# Altium project BeagleNode.PrjPcb
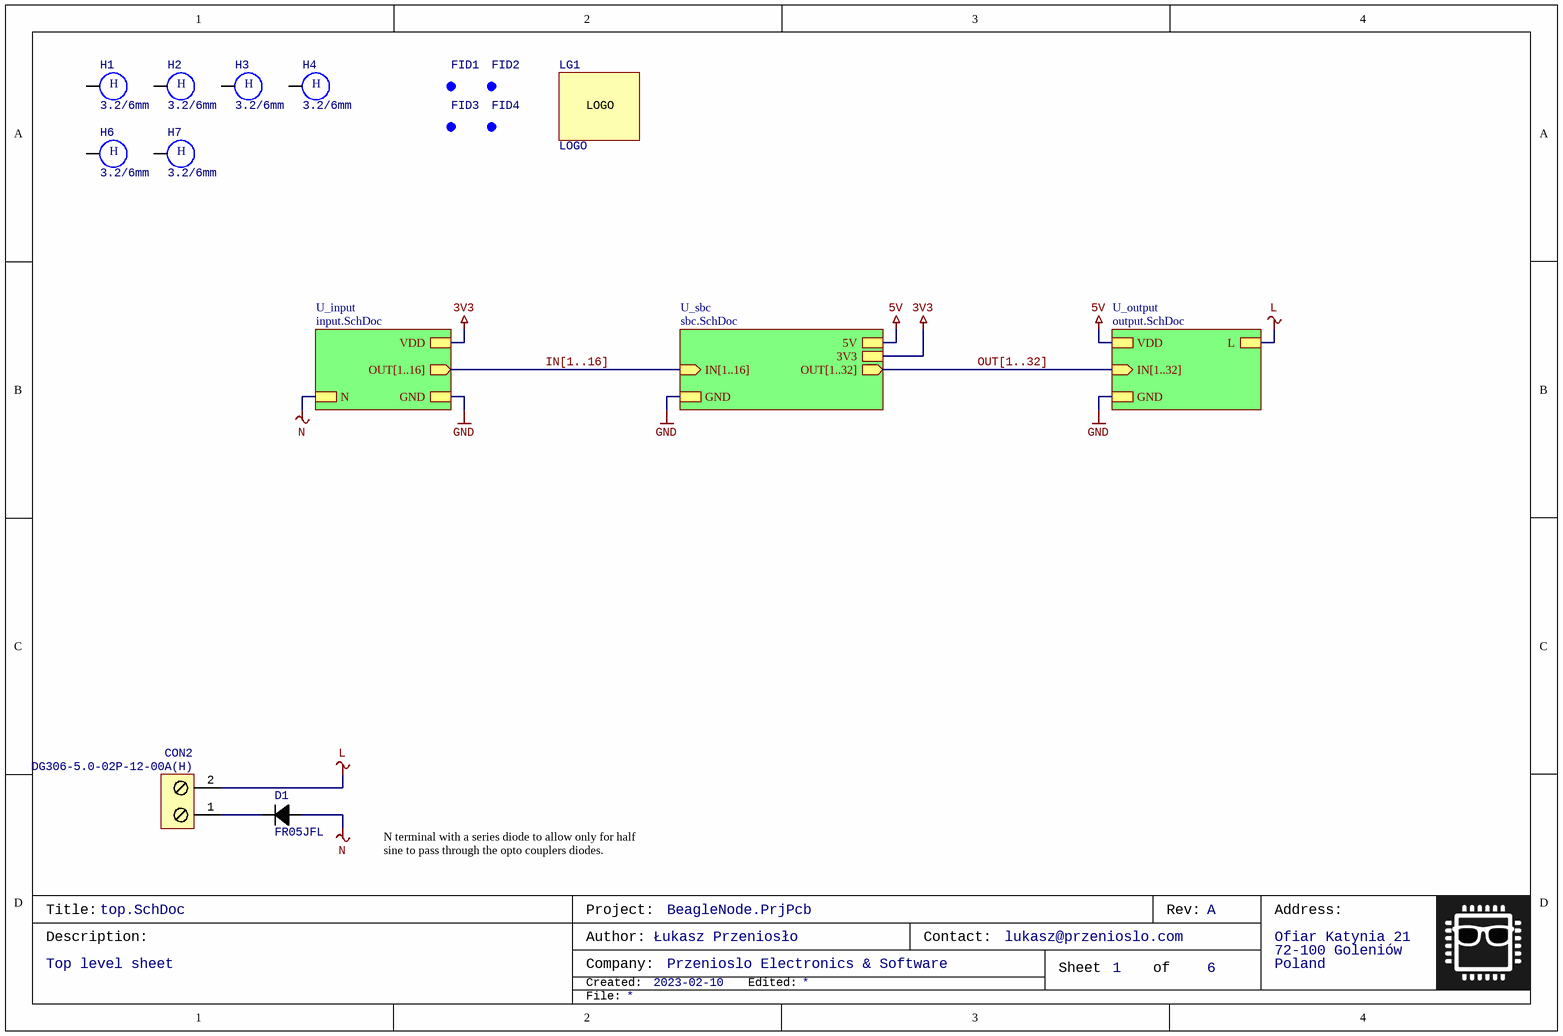
[diagram p0: top.SchDoc]
Author: Łukasz Przeniosło; CompanyName: Przenioslo Electronics & Software; Engineer: lukasz@przenioslo.com; Revision: A
6 sheets, 246 parts. Net scope: strictly hierarchical (ports join the sheet entries above them; power ports are local).
Board file: BeagleNode_revA.PcbDoc
Sheets:
  top.SchDoc
    U_input = input.SchDoc
      IA = opto.SchDoc
      IB = opto.SchDoc
      IC = opto.SchDoc
      ID = opto.SchDoc
    U_output = output.SchDoc
      K1 = relay.SchDoc
      K2 = relay.SchDoc
      K3 = relay.SchDoc
      K4 = relay.SchDoc
      K5 = relay.SchDoc
      K6 = relay.SchDoc
      K7 = relay.SchDoc
      K8 = relay.SchDoc
      K9 = relay.SchDoc
      K10 = relay.SchDoc
      K11 = relay.SchDoc
      K12 = relay.SchDoc
      K13 = relay.SchDoc
      K14 = relay.SchDoc
      K15 = relay.SchDoc
      K16 = relay.SchDoc
    U_sbc = sbc.SchDoc

## Sheet top.SchDoc: Top level sheet
size A4; Date: 2023-02-10; DocumentNumber: 1; SheetNumber: 1; SheetTotal: 6

### Parts
CON2  DG306-5.0-02P-12-00A(H)  [Terminal-block-2way-5.0]
D1  FR05JFL  [SOD323]
FID1  Generic fidutial  [FID_ROUND]  (value not drawn)  (no BOM)
FID2  Generic fidutial  [FID_ROUND]  (value not drawn)  (no BOM)
FID3  Generic fidutial  [FID_ROUND]  (value not drawn)  (no BOM)
FID4  Generic fidutial  [FID_ROUND]  (value not drawn)  (no BOM)
H1  3.2/6mm  [hole-3.2/6]  (no BOM)
H2  3.2/6mm  [hole-3.2/6]  (no BOM)
H3  3.2/6mm  [hole-3.2/6]  (no BOM)
H4  3.2/6mm  [hole-3.2/6]  (no BOM)
H6  3.2/6mm  [hole-3.2/6]  (no BOM)
H7  3.2/6mm  [hole-3.2/6]  (no BOM)
LG1  LOGO  [LOGO_ENS]  (no BOM)

### Sub-sheets
U_input = input.SchDoc: OUT[1..16] (out), VDD, GND, N
U_output = output.SchDoc: L, VDD, GND, IN[1..32] (in)
U_sbc = sbc.SchDoc: 3V3, GND, 5V, IN[1..16] (in), OUT[1..32] (out)

### Nets
3V3: sheet U_input/VDD, sheet U_sbc/3V3
5V: sheet U_output/VDD, sheet U_sbc/5V
GND: sheet U_input/GND, sheet U_output/GND, sheet U_sbc/GND
L: CON2.2 ; sheet U_output/L
N: D1.2(A) ; sheet U_input/N
NetCON2_1: CON2.1 D1.1(K)

Not connected (* = marked no-connect by the designer): H1 1; H2 1; H3 1; H4 1; H6 1; H7 1

### Buses and harness runs
bus IN[1..16] = sheet U_input/OUT[1..16] = sheet U_sbc/IN[1..16]
bus OUT[1..32] = sheet U_output/IN[1..32] = sheet U_sbc/OUT[1..32]

### Notes on the sheet
- N terminal with a series diode to allow only for half sine to pass through the opto couplers diodes.
- Title:
- Project:
- Rev:
- Address:
- Description:
- Created:
- Author:
- Company:
- Edited:
- Contact:
- Sheet
- of
- Ofiar Katynia 21
- 72-100 Goleniów
- Poland
- File:
- (in symbol hole_metalized) H

### Library data of the parts
CON2 = Terminal Block 2: Screwed terminal block with 2 pins; Manufacturer: DEGSON ELECTRONICS; Identifier: DG306-5.0-02P-12-00A(H)
D1 = FR05xFL: FAST RECOVERY SURFACE MOUNT GLASS PASSIVATED RECTIFIER; Manufacturer: DC Components; V_R: 600V; I_F: 0.5A; V_F: 1.3V; Identifier: FR05JFL
FID1-FID4 = FID: Optical alignement fidutial PCB element (not visible in bom); Identifier: Generic fidutial
H1-H4 H6 H7 = hole_metalized: Generic hole component with 1 electrical connection; size: 3.2/6mm
LG1 = LOGO: Logo graphical object

## Sheet input.SchDoc: 230 VAC switches inputs connectors circuit
size A4; Date: 2023-02-07; Organization: PRZENIOSLO; Address1: Electronics; Address2: &; Address3: Software; DocumentNumber: 2; SheetNumber: 2; SheetTotal: 6
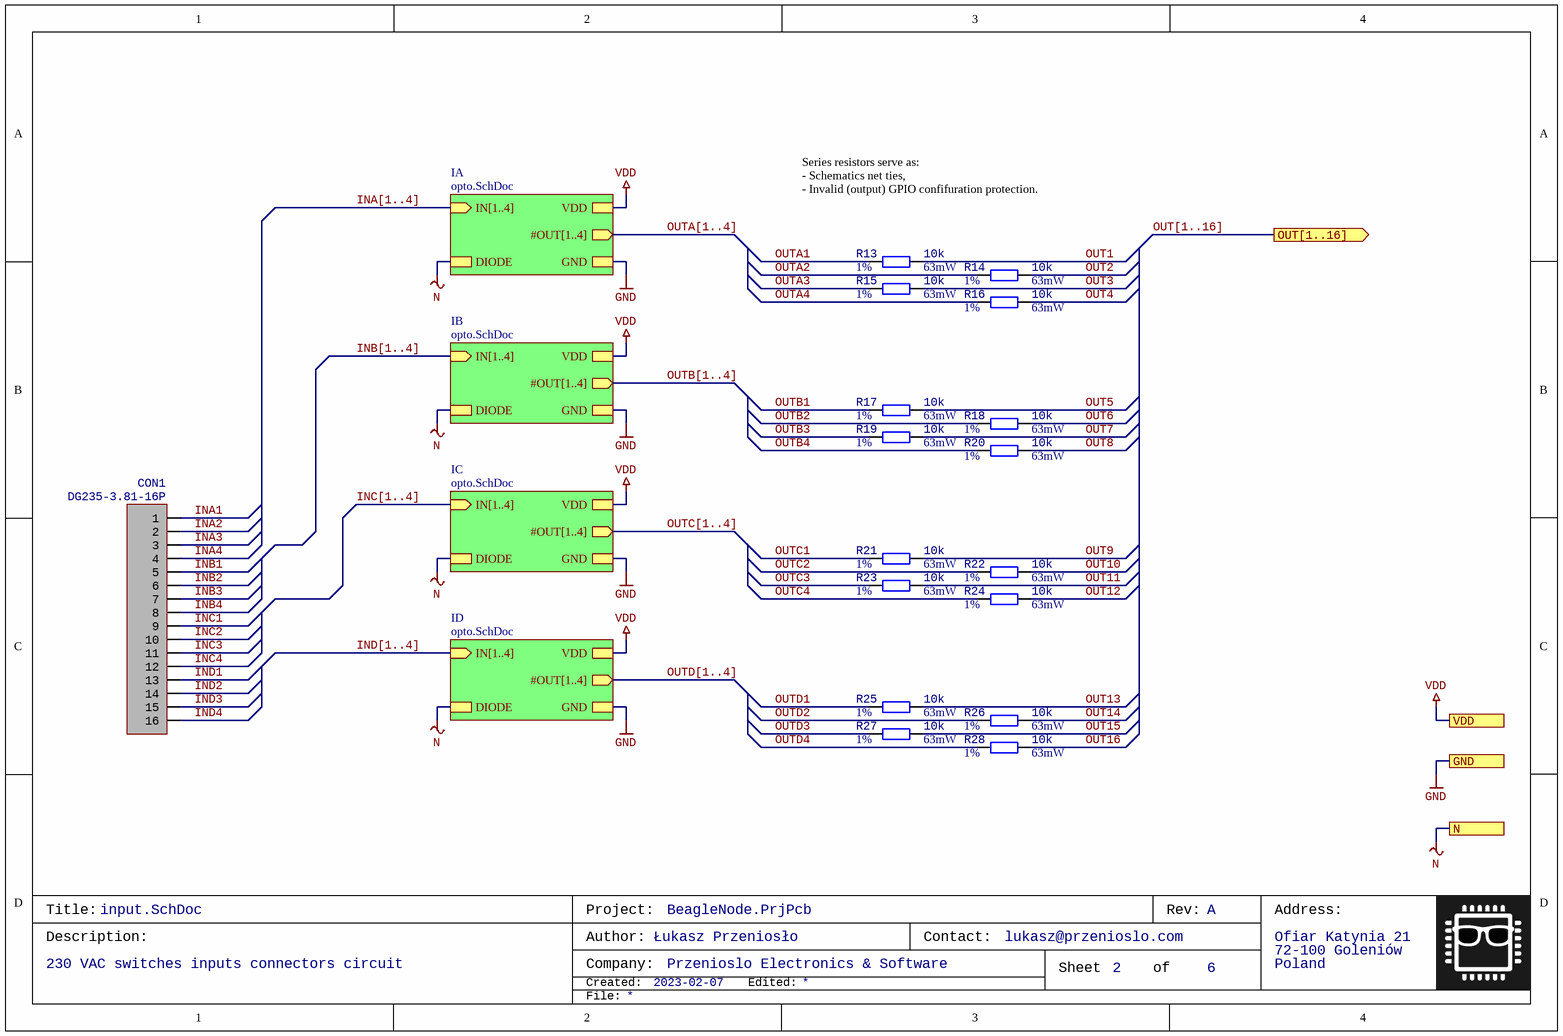
[diagram p1: input.SchDoc]

### Parts
CON1  DG235-3.81-16P  [DG235-3.81-16P]
R13  10k  Power: 63mW  Tolerance: 1%  [RES0603]
R14  10k  Power: 63mW  Tolerance: 1%  [RES0603]
R15  10k  Power: 63mW  Tolerance: 1%  [RES0603]
R16  10k  Power: 63mW  Tolerance: 1%  [RES0603]
R17  10k  Power: 63mW  Tolerance: 1%  [RES0603]
R18  10k  Power: 63mW  Tolerance: 1%  [RES0603]
R19  10k  Power: 63mW  Tolerance: 1%  [RES0603]
R20  10k  Power: 63mW  Tolerance: 1%  [RES0603]
R21  10k  Power: 63mW  Tolerance: 1%  [RES0603]
R22  10k  Power: 63mW  Tolerance: 1%  [RES0603]
R23  10k  Power: 63mW  Tolerance: 1%  [RES0603]
R24  10k  Power: 63mW  Tolerance: 1%  [RES0603]
R25  10k  Power: 63mW  Tolerance: 1%  [RES0603]
R26  10k  Power: 63mW  Tolerance: 1%  [RES0603]
R27  10k  Power: 63mW  Tolerance: 1%  [RES0603]
R28  10k  Power: 63mW  Tolerance: 1%  [RES0603]

### Sub-sheets
IA = opto.SchDoc: #OUT[1..4] (out), IN[1..4] (in), DIODE, VDD, GND
IB = opto.SchDoc: #OUT[1..4] (out), IN[1..4] (in), DIODE, VDD, GND
IC = opto.SchDoc: #OUT[1..4] (out), IN[1..4] (in), DIODE, VDD, GND
ID = opto.SchDoc: #OUT[1..4] (out), IN[1..4] (in), DIODE, VDD, GND

### Ports
GND, N, OUT[1..16] (out), VDD

### Nets
GND: port GND, sheet IA/GND, sheet IB/GND, sheet IC/GND, sheet ID/GND
N: port N, sheet IA/DIODE, sheet IB/DIODE, sheet IC/DIODE, sheet ID/DIODE
VDD: port VDD, sheet IA/VDD, sheet IB/VDD, sheet IC/VDD, sheet ID/VDD  [project net 3V3]
INA1: CON1.1  [project net INA1_2]
INA2: CON1.2  [project net INA2_2]
INA3: CON1.3  [project net INA3_2]
INA4: CON1.4  [project net INA4_2]
INB1: CON1.5  [project net INB1_2]
INB2: CON1.6  [project net INB2_2]
INB3: CON1.7  [project net INB3_2]
INB4: CON1.8  [project net INB4_2]
INC1: CON1.9  [project net INC1_2]
INC2: CON1.10  [project net INC2_2]
INC3: CON1.11  [project net INC3_2]
INC4: CON1.12  [project net INC4_2]
IND1: CON1.13  [project net IND1_2]
IND2: CON1.14  [project net IND2_2]
IND3: CON1.15  [project net IND3_2]
IND4: CON1.16  [project net IND4_2]
OUT1: R13.1  [project net IN1]
OUT2: R14.1  [project net IN2]
OUT3: R15.1  [project net IN3]
OUT4: R16.1  [project net IN4]
OUT5: R17.1  [project net IN5]
OUT6: R18.1  [project net IN6]
OUT7: R19.1  [project net IN7]
OUT8: R20.1  [project net IN8]
OUT9: R21.1  [project net IN9]
OUT10: R22.1  [project net IN10]
OUT11: R23.1  [project net IN11]
OUT12: R24.1  [project net IN12]
OUT13: R25.1  [project net IN13]
OUT14: R26.1  [project net IN14]
OUT15: R27.1  [project net IN15]
OUT16: R28.1  [project net IN16]
OUTA1: R13.2
OUTA2: R14.2
OUTA3: R15.2
OUTA4: R16.2
OUTB1: R17.2
OUTB2: R18.2
OUTB3: R19.2
OUTB4: R20.2
OUTC1: R21.2
OUTC2: R22.2
OUTC3: R23.2
OUTC4: R24.2
OUTD1: R25.2
OUTD2: R26.2
OUTD3: R27.2
OUTD4: R28.2

### Buses and harness runs
bus INA[1..4] = sheet IA/IN[1..4]
bus INB[1..4] = sheet IB/IN[1..4]
bus INC[1..4] = sheet IC/IN[1..4]
bus IND[1..4] = sheet ID/IN[1..4]
bus OUT[1..16] = port OUT[1..16]
bus OUTA[1..4] = sheet IA/#OUT[1..4]
bus OUTB[1..4] = sheet IB/#OUT[1..4]
bus OUTC[1..4] = sheet IC/#OUT[1..4]
bus OUTD[1..4] = sheet ID/#OUT[1..4]

### Notes on the sheet
- Series resistors serve as:
  - Schematics net ties,
  - Invalid (output) GPIO confifuration protection.
- Title:
- Project:
- Rev:
- Address:
- Description:
- Created:
- Author:
- Company:
- Edited:
- Contact:
- Sheet
- of
- Ofiar Katynia 21
- 72-100 Goleniów
- Poland
- File:

### Library data of the parts
CON1 = DG235-3.81-16P: PCB spring terminal blocks,Rated current:10A.Rated voltage （III/2）:250V,pitch:3.81mm,Color:gray,Contact surface :Tin; Manufacturer: DEGSON ELECTRONICS; Nominal Current: 5A; Identifier: DG235-3.81-16P
R13-R28 = Resistor: Generic resistor symbol; Value: 10k; Manufacturer: *; Identifier: *; Datasheet: *

## Sheet opto.SchDoc: High voltage quad opto isolation circuit
size A4; Date: 20xx-xx-xx; Author: Łukasz Przeniosło; CompanyName: Przenioslo Electronics & Software; Engineer: lukasz@przenioslo.com; Organization: PRZENIOSLO; Address1: Electronics; Address2: &; Address3: Software; DocumentNumber: 3; SheetNumber: 3; SheetTotal: 6
Used 4 times, as channels U_input/IA, U_input/IB, U_input/IC, U_input/ID. Parts and nets are listed once, with the designators drawn on the sheet.
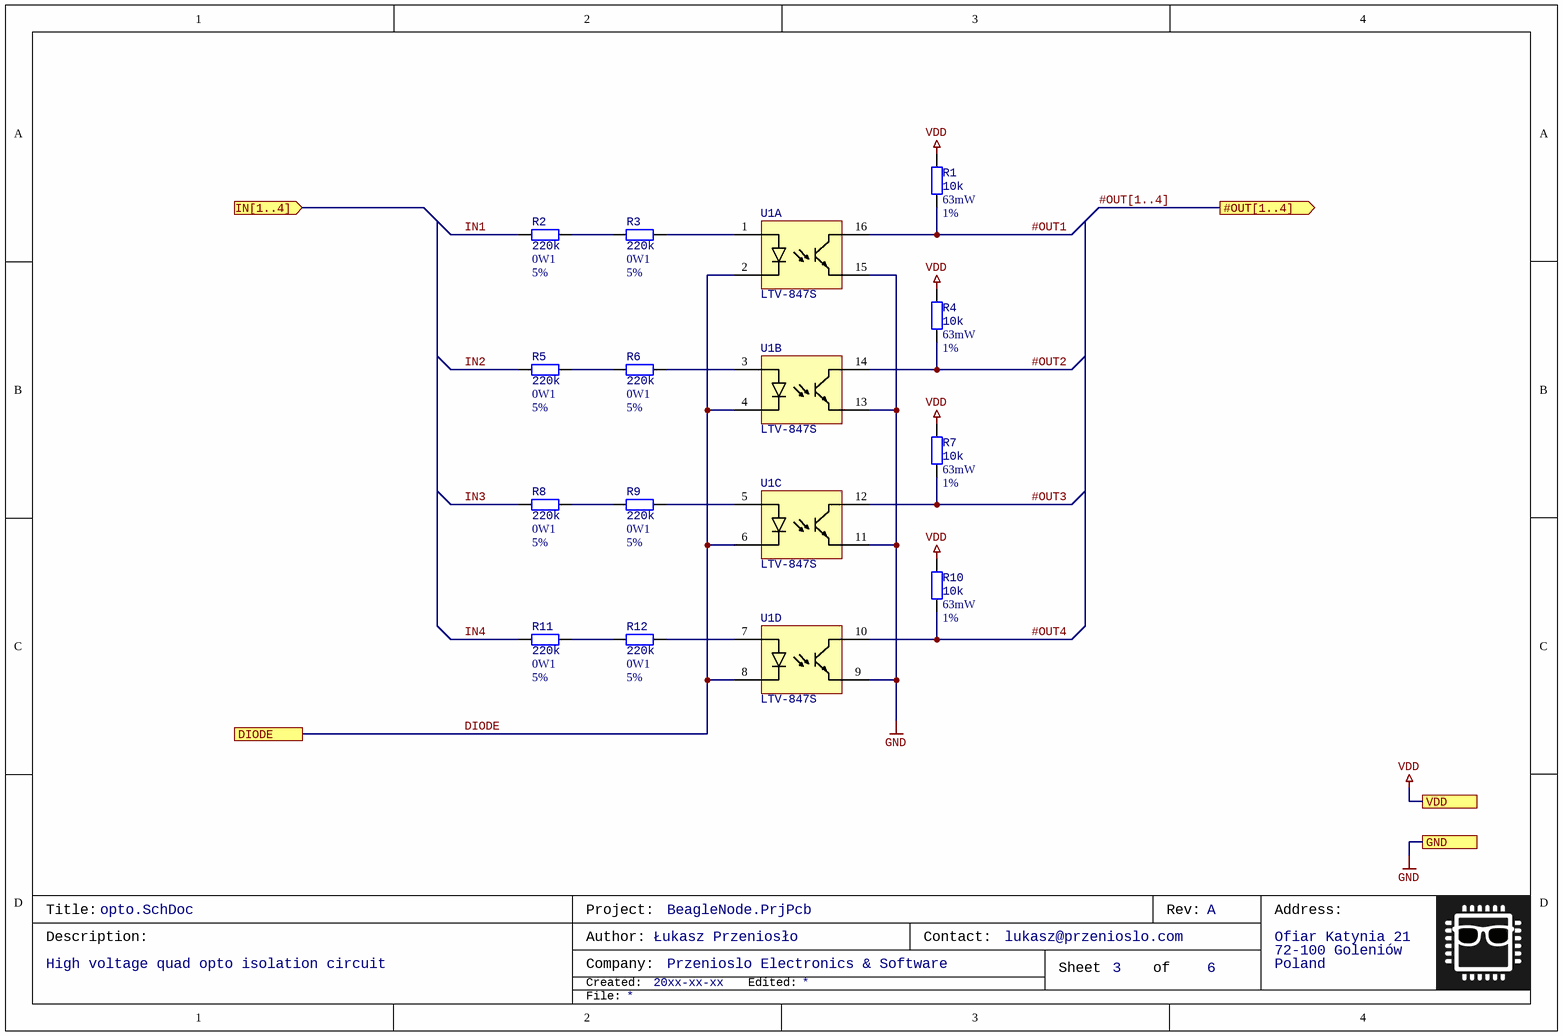
[diagram p2: opto.SchDoc]

### Parts
R1  10k  Power: 63mW  Tolerance: 1%  [RES0603]
R2  220k  Power: 0W1  Tolerance: 5%  [RES0603]
R3  220k  Power: 0W1  Tolerance: 5%  [RES0603]
R4  10k  Power: 63mW  Tolerance: 1%  [RES0603]
R5  220k  Power: 0W1  Tolerance: 5%  [RES0603]
R6  220k  Power: 0W1  Tolerance: 5%  [RES0603]
R7  10k  Power: 63mW  Tolerance: 1%  [RES0603]
R8  220k  Power: 0W1  Tolerance: 5%  [RES0603]
R9  220k  Power: 0W1  Tolerance: 5%  [RES0603]
R10  10k  Power: 63mW  Tolerance: 1%  [RES0603]
R11  220k  Power: 0W1  Tolerance: 5%  [RES0603]
R12  220k  Power: 0W1  Tolerance: 5%  [RES0603]
U1  LTV-847S  [GULLWING16]  (parts A,B,C,D of 4)

### Ports
#OUT[1..4] (out), DIODE, GND, IN[1..4] (in), VDD

### Nets
GND: U1.9(E4) U1.11(E3) U1.13(E2) U1.15(E1) ; port GND
VDD: R1.2 R4.2 R7.2 R10.2 ; port VDD
#OUT1: R1.1 U1.16(C1)  [project net #OUT1_3]
#OUT2: R4.1 U1.14(C2)  [project net #OUT2_3]
#OUT3: R7.1 U1.12(C3)  [project net #OUT3_3]
#OUT4: R10.1 U1.10(C4)  [project net #OUT4_3]
DIODE: U1.2(K1) U1.4(K2) U1.6(K3) U1.8(K4) ; port DIODE
IN1: R2.2  [project net IN1_3]
IN2: R5.2  [project net IN2_3]
IN3: R8.2  [project net IN3_3]
IN4: R11.2  [project net IN4_3]
NetR2_1: R2.1 R3.2
NetR3_1: R3.1 U1.1(A1)
NetR5_1: R5.1 R6.2
NetR6_1: R6.1 U1.3(A2)
NetR8_1: R8.1 R9.2
NetR9_1: R9.1 U1.5(A3)
NetR11_1: R11.1 R12.2
NetR12_1: R12.1 U1.7(A4)

### Channels
U_input/IA: designators R1=IAR1 R2=IAR2 R3=IAR3 R4=IAR4 R5=IAR5 R6=IAR6 R7=IAR7 R8=IAR8 R9=IAR9 R10=IAR10 R11=IAR11 R12=IAR12 U1=IAU1; ports DIODE=N GND=GND VDD=3V3
U_input/IB: designators R1=IBR1 R2=IBR2 R3=IBR3 R4=IBR4 R5=IBR5 R6=IBR6 R7=IBR7 R8=IBR8 R9=IBR9 R10=IBR10 R11=IBR11 R12=IBR12 U1=IBU1; ports DIODE=N GND=GND VDD=3V3
U_input/IC: designators R1=ICR1 R2=ICR2 R3=ICR3 R4=ICR4 R5=ICR5 R6=ICR6 R7=ICR7 R8=ICR8 R9=ICR9 R10=ICR10 R11=ICR11 R12=ICR12 U1=ICU1; ports DIODE=N GND=GND VDD=3V3
U_input/ID: designators R1=IDR1 R2=IDR2 R3=IDR3 R4=IDR4 R5=IDR5 R6=IDR6 R7=IDR7 R8=IDR8 R9=IDR9 R10=IDR10 R11=IDR11 R12=IDR12 U1=IDU1; ports DIODE=N GND=GND VDD=3V3

### Buses and harness runs
bus #OUT[1..4] = port #OUT[1..4]

### Notes on the sheet
- Title:
- Project:
- Rev:
- Address:
- Description:
- Created:
- Author:
- Company:
- Edited:
- Contact:
- Sheet
- of
- Ofiar Katynia 21
- 72-100 Goleniów
- Poland
- File:

### Library data of the parts
R1-R12 = Resistor: Generic resistor symbol; Manufacturer: *; Identifier: *; Datasheet: *
  R1 R4 R7 R10: Value: 10k
  R2 R3 R5 R6 R8 R9 R11 R12: Value: 220k
U1 = Transoptor_16pin: Quad transoptor in 16 pin package; Manufacturer: Liteon; Identifier: LTV-847S

## Sheet output.SchDoc: 230 VAC outputs connector circuit
size A4; Date: 2023-02-11; DocumentNumber: 4; SheetNumber: 4; SheetTotal: 6
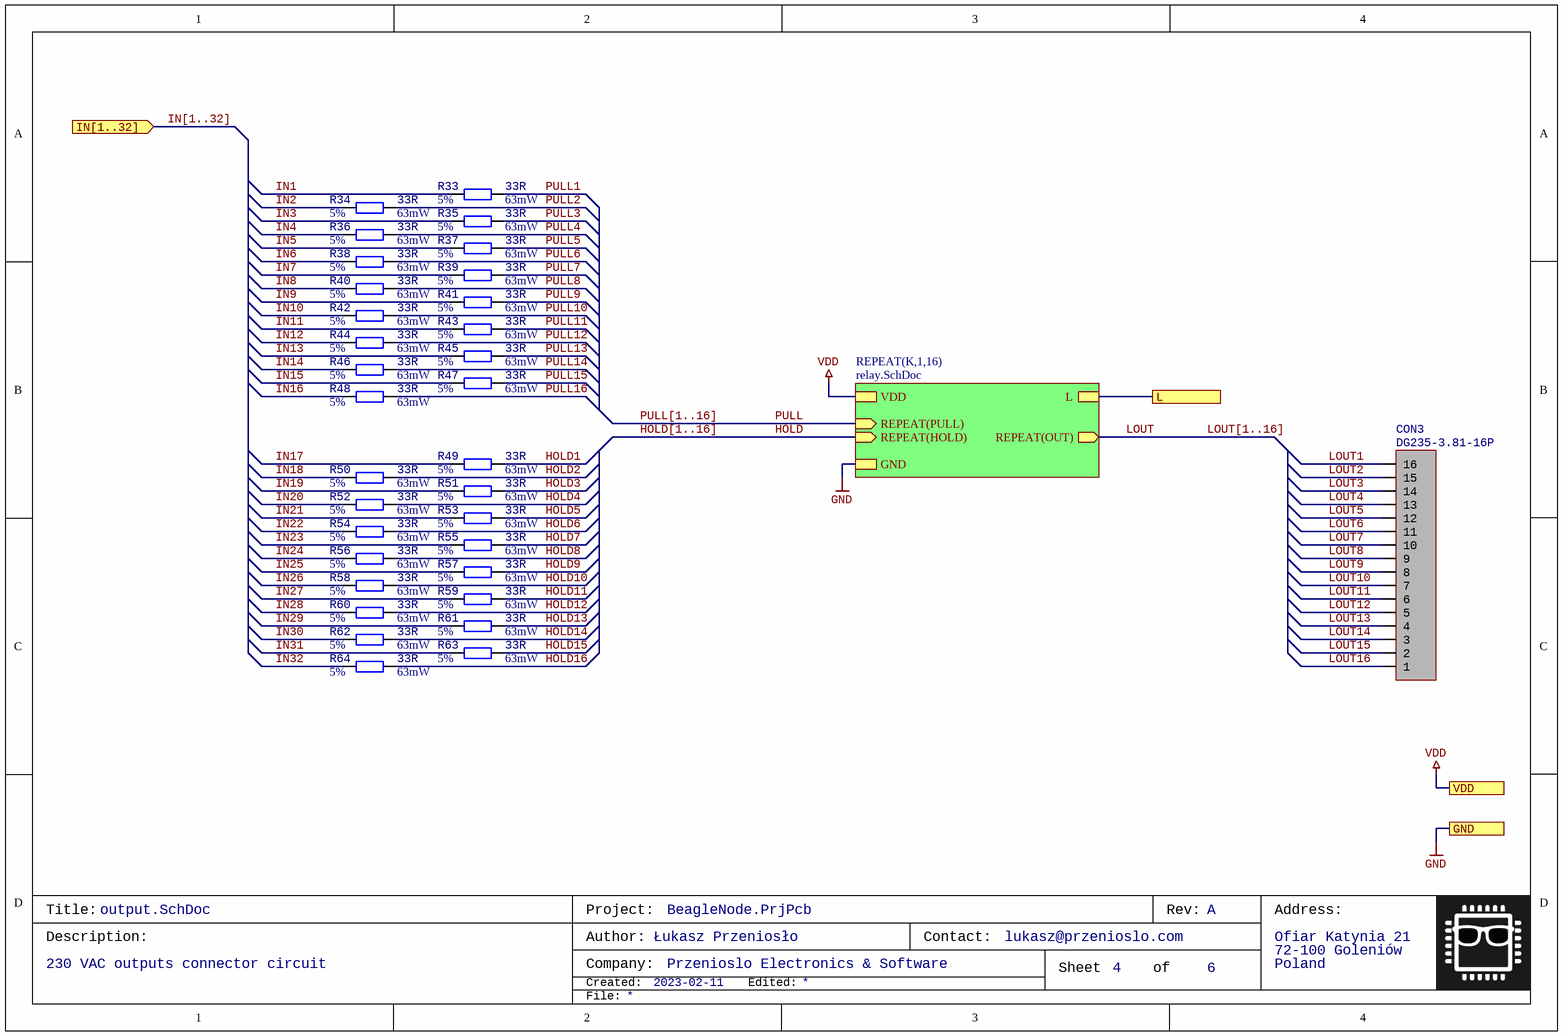
[diagram p3: output.SchDoc]

### Parts
CON3  DG235-3.81-16P  [DG235-3.81-16P]
R33  33R  Power: 63mW  Tolerance: 5%  [RES0603]
R34  33R  Power: 63mW  Tolerance: 5%  [RES0603]
R35  33R  Power: 63mW  Tolerance: 5%  [RES0603]
R36  33R  Power: 63mW  Tolerance: 5%  [RES0603]
R37  33R  Power: 63mW  Tolerance: 5%  [RES0603]
R38  33R  Power: 63mW  Tolerance: 5%  [RES0603]
R39  33R  Power: 63mW  Tolerance: 5%  [RES0603]
R40  33R  Power: 63mW  Tolerance: 5%  [RES0603]
R41  33R  Power: 63mW  Tolerance: 5%  [RES0603]
R42  33R  Power: 63mW  Tolerance: 5%  [RES0603]
R43  33R  Power: 63mW  Tolerance: 5%  [RES0603]
R44  33R  Power: 63mW  Tolerance: 5%  [RES0603]
R45  33R  Power: 63mW  Tolerance: 5%  [RES0603]
R46  33R  Power: 63mW  Tolerance: 5%  [RES0603]
R47  33R  Power: 63mW  Tolerance: 5%  [RES0603]
R48  33R  Power: 63mW  Tolerance: 5%  [RES0603]
R49  33R  Power: 63mW  Tolerance: 5%  [RES0603]
R50  33R  Power: 63mW  Tolerance: 5%  [RES0603]
R51  33R  Power: 63mW  Tolerance: 5%  [RES0603]
R52  33R  Power: 63mW  Tolerance: 5%  [RES0603]
R53  33R  Power: 63mW  Tolerance: 5%  [RES0603]
R54  33R  Power: 63mW  Tolerance: 5%  [RES0603]
R55  33R  Power: 63mW  Tolerance: 5%  [RES0603]
R56  33R  Power: 63mW  Tolerance: 5%  [RES0603]
R57  33R  Power: 63mW  Tolerance: 5%  [RES0603]
R58  33R  Power: 63mW  Tolerance: 5%  [RES0603]
R59  33R  Power: 63mW  Tolerance: 5%  [RES0603]
R60  33R  Power: 63mW  Tolerance: 5%  [RES0603]
R61  33R  Power: 63mW  Tolerance: 5%  [RES0603]
R62  33R  Power: 63mW  Tolerance: 5%  [RES0603]
R63  33R  Power: 63mW  Tolerance: 5%  [RES0603]
R64  33R  Power: 63mW  Tolerance: 5%  [RES0603]

### Sub-sheets
REPEAT(K,1,16) = relay.SchDoc: REPEAT(OUT) (out), L, REPEAT(PULL) (in), REPEAT(HOLD) (in), VDD, GND

### Ports
GND, IN[1..32] (in), L, VDD

### Nets
GND: port GND, sheet REPEAT(K,1,16)/GND
L: port L, sheet REPEAT(K,1,16)/L
VDD: port VDD, sheet REPEAT(K,1,16)/VDD  [project net 5V]
HOLD: sheet REPEAT(K,1,16)/REPEAT(HOLD)
HOLD1: R49.2
HOLD2: R50.2
HOLD3: R51.2
HOLD4: R52.2
HOLD5: R53.2
HOLD6: R54.2
HOLD7: R55.2
HOLD8: R56.2
HOLD9: R57.2
HOLD10: R58.2
HOLD11: R59.2
HOLD12: R60.2
HOLD13: R61.2
HOLD14: R62.2
HOLD15: R63.2
HOLD16: R64.2
IN1: R33.1  [project net OUT1]
IN2: R34.1  [project net OUT2]
IN3: R35.1  [project net OUT3]
IN4: R36.1  [project net OUT4]
IN5: R37.1  [project net OUT5]
IN6: R38.1  [project net OUT6]
IN7: R39.1  [project net OUT7]
IN8: R40.1  [project net OUT8]
IN9: R41.1  [project net OUT9]
IN10: R42.1  [project net OUT10]
IN11: R43.1  [project net OUT11]
IN12: R44.1  [project net OUT12]
IN13: R45.1  [project net OUT13]
IN14: R46.1  [project net OUT14]
IN15: R47.1  [project net OUT15]
IN16: R48.1  [project net OUT16]
IN17: R49.1  [project net OUT17]
IN18: R50.1  [project net OUT18]
IN19: R51.1  [project net OUT19]
IN20: R52.1  [project net OUT20]
IN21: R53.1  [project net OUT21]
IN22: R54.1  [project net OUT22]
IN23: R55.1  [project net OUT23]
IN24: R56.1  [project net OUT24]
IN25: R57.1  [project net OUT25]
IN26: R58.1  [project net OUT26]
IN27: R59.1  [project net OUT27]
IN28: R60.1  [project net OUT28]
IN29: R61.1  [project net OUT29]
IN30: R62.1  [project net OUT30]
IN31: R63.1  [project net OUT31]
IN32: R64.1  [project net OUT32]
LOUT: sheet REPEAT(K,1,16)/REPEAT(OUT)
LOUT1: CON3.16
LOUT2: CON3.15
LOUT3: CON3.14
LOUT4: CON3.13
LOUT5: CON3.12
LOUT6: CON3.11
LOUT7: CON3.10
LOUT8: CON3.9
LOUT9: CON3.8
LOUT10: CON3.7
LOUT11: CON3.6
LOUT12: CON3.5
LOUT13: CON3.4
LOUT14: CON3.3
LOUT15: CON3.2
LOUT16: CON3.1
PULL: sheet REPEAT(K,1,16)/REPEAT(PULL)
PULL1: R33.2
PULL2: R34.2
PULL3: R35.2
PULL4: R36.2
PULL5: R37.2
PULL6: R38.2
PULL7: R39.2
PULL8: R40.2
PULL9: R41.2
PULL10: R42.2
PULL11: R43.2
PULL12: R44.2
PULL13: R45.2
PULL14: R46.2
PULL15: R47.2
PULL16: R48.2

### Buses and harness runs
bus HOLD[1..16]
bus IN[1..32] = port IN[1..32]
bus LOUT[1..16]
bus PULL[1..16]

### Notes on the sheet
- Title:
- Project:
- Rev:
- Address:
- Description:
- Created:
- Author:
- Company:
- Edited:
- Contact:
- Sheet
- of
- Ofiar Katynia 21
- 72-100 Goleniów
- Poland
- File:

### Library data of the parts
CON3 = DG235-3.81-16P: as CON1 on sheet input; Identifier: DG235-3.81-16P
R33-R64 = Resistor: Generic resistor symbol; Value: 33R; Manufacturer: *; Identifier: *; Datasheet: *

## Sheet relay.SchDoc: 230 VAC output relay control circuit
size A4; Date: 2023-02-10; DocumentNumber: 5; SheetNumber: 6; SheetTotal: 6
Used 16 times, as channels U_output/K1, U_output/K2, U_output/K3, U_output/K4, U_output/K5, U_output/K6, U_output/K7, U_output/K8, U_output/K9, U_output/K10, U_output/K11, U_output/K12, U_output/K13, U_output/K14, U_output/K15, U_output/K16. Parts and nets are listed once, with the designators drawn on the sheet.
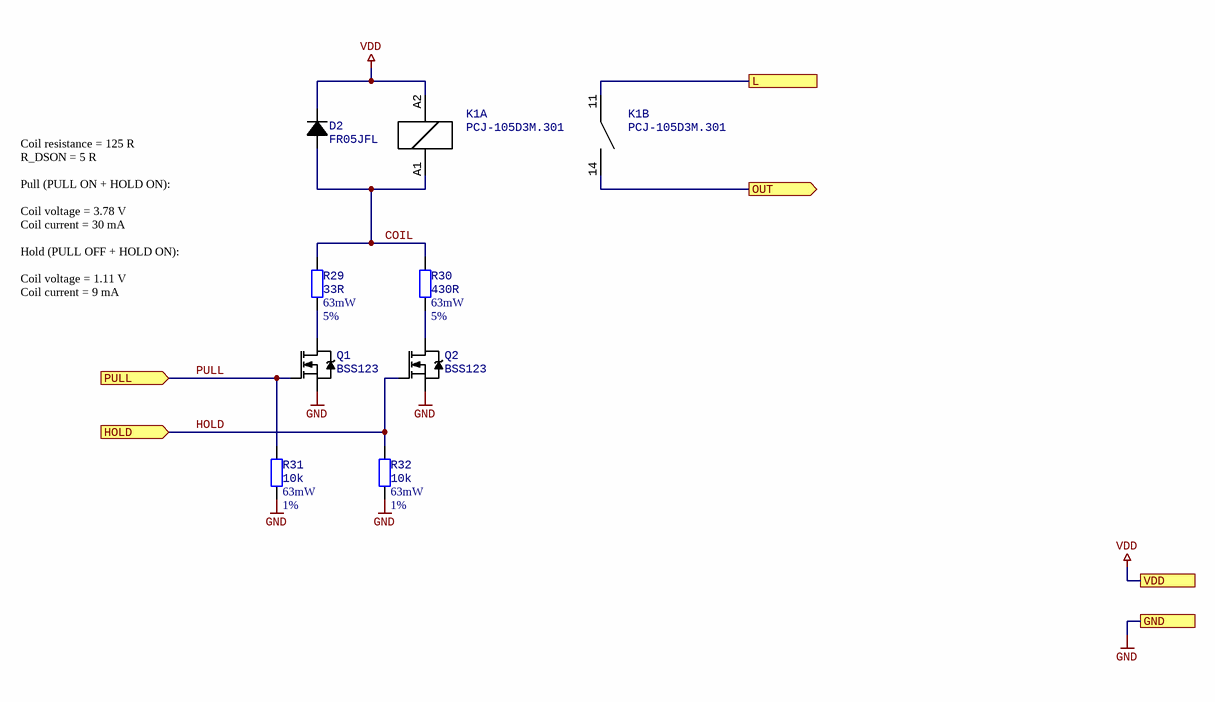
[diagram p4: relay.SchDoc]

### Parts
D2  FR05JFL  [SOD323]
K1  PCJ-105D3M.301  [1721081-2]  (parts A,B of 2)
Q1  BSS123  [sot23-3l]
Q2  BSS123  [sot23-3l]
R29  33R  Power: 63mW  Tolerance: 5%  [RES0603]
R30  430R  Power: 63mW  Tolerance: 5%  [RES0603]
R31  10k  Power: 63mW  Tolerance: 1%  [RES0603]
R32  10k  Power: 63mW  Tolerance: 1%  [RES0603]

### Ports
GND, HOLD (in), L, OUT (out), PULL (in), VDD

### Nets
GND: Q1.2(S) Q2.2(S) R31.2 R32.2 ; port GND
VDD: D2.1(K) K1.A2 ; port VDD
COIL: D2.2(A) K1.A1 R29.1 R30.1  [project net COIL_6]
HOLD: Q2.1(G) R32.1 ; port HOLD
L: K1.11 ; port L
OUT: K1.14 ; port OUT
PULL: Q1.1(G) R31.1 ; port PULL
NetQ1_3: Q1.3(D) R29.2
NetQ2_3: Q2.3(D) R30.2

### Channels
U_output/K1: designators D2=K1D2 K1=K1K1 Q1=K1Q1 Q2=K1Q2 R29=K1R29 R30=K1R30 R31=K1R31 R32=K1R32; ports GND=GND HOLD=HOLD1 L=L OUT=LOUT1 PULL=PULL1 VDD=5V
U_output/K2: designators D2=K2D2 K1=K2K1 Q1=K2Q1 Q2=K2Q2 R29=K2R29 R30=K2R30 R31=K2R31 R32=K2R32; ports GND=GND HOLD=HOLD2 L=L OUT=LOUT2 PULL=PULL2 VDD=5V
U_output/K3: designators D2=K3D2 K1=K3K1 Q1=K3Q1 Q2=K3Q2 R29=K3R29 R30=K3R30 R31=K3R31 R32=K3R32; ports GND=GND HOLD=HOLD3 L=L OUT=LOUT3 PULL=PULL3 VDD=5V
U_output/K4: designators D2=K4D2 K1=K4K1 Q1=K4Q1 Q2=K4Q2 R29=K4R29 R30=K4R30 R31=K4R31 R32=K4R32; ports GND=GND HOLD=HOLD4 L=L OUT=LOUT4 PULL=PULL4 VDD=5V
U_output/K5: designators D2=K5D2 K1=K5K1 Q1=K5Q1 Q2=K5Q2 R29=K5R29 R30=K5R30 R31=K5R31 R32=K5R32; ports GND=GND HOLD=HOLD5 L=L OUT=LOUT5 PULL=PULL5 VDD=5V
U_output/K6: designators D2=K6D2 K1=K6K1 Q1=K6Q1 Q2=K6Q2 R29=K6R29 R30=K6R30 R31=K6R31 R32=K6R32; ports GND=GND HOLD=HOLD6 L=L OUT=LOUT6 PULL=PULL6 VDD=5V
U_output/K7: designators D2=K7D2 K1=K7K1 Q1=K7Q1 Q2=K7Q2 R29=K7R29 R30=K7R30 R31=K7R31 R32=K7R32; ports GND=GND HOLD=HOLD7 L=L OUT=LOUT7 PULL=PULL7 VDD=5V
U_output/K8: designators D2=K8D2 K1=K8K1 Q1=K8Q1 Q2=K8Q2 R29=K8R29 R30=K8R30 R31=K8R31 R32=K8R32; ports GND=GND HOLD=HOLD8 L=L OUT=LOUT8 PULL=PULL8 VDD=5V
U_output/K9: designators D2=K9D2 K1=K9K1 Q1=K9Q1 Q2=K9Q2 R29=K9R29 R30=K9R30 R31=K9R31 R32=K9R32; ports GND=GND HOLD=HOLD9 L=L OUT=LOUT9 PULL=PULL9 VDD=5V
U_output/K10: designators D2=K10D2 K1=K10K1 Q1=K10Q1 Q2=K10Q2 R29=K10R29 R30=K10R30 R31=K10R31 R32=K10R32; ports GND=GND HOLD=HOLD10 L=L OUT=LOUT10 PULL=PULL10 VDD=5V
U_output/K11: designators D2=K11D2 K1=K11K1 Q1=K11Q1 Q2=K11Q2 R29=K11R29 R30=K11R30 R31=K11R31 R32=K11R32; ports GND=GND HOLD=HOLD11 L=L OUT=LOUT11 PULL=PULL11 VDD=5V
U_output/K12: designators D2=K12D2 K1=K12K1 Q1=K12Q1 Q2=K12Q2 R29=K12R29 R30=K12R30 R31=K12R31 R32=K12R32; ports GND=GND HOLD=HOLD12 L=L OUT=LOUT12 PULL=PULL12 VDD=5V
U_output/K13: designators D2=K13D2 K1=K13K1 Q1=K13Q1 Q2=K13Q2 R29=K13R29 R30=K13R30 R31=K13R31 R32=K13R32; ports GND=GND HOLD=HOLD13 L=L OUT=LOUT13 PULL=PULL13 VDD=5V
U_output/K14: designators D2=K14D2 K1=K14K1 Q1=K14Q1 Q2=K14Q2 R29=K14R29 R30=K14R30 R31=K14R31 R32=K14R32; ports GND=GND HOLD=HOLD14 L=L OUT=LOUT14 PULL=PULL14 VDD=5V
U_output/K15: designators D2=K15D2 K1=K15K1 Q1=K15Q1 Q2=K15Q2 R29=K15R29 R30=K15R30 R31=K15R31 R32=K15R32; ports GND=GND HOLD=HOLD15 L=L OUT=LOUT15 PULL=PULL15 VDD=5V
U_output/K16: designators D2=K16D2 K1=K16K1 Q1=K16Q1 Q2=K16Q2 R29=K16R29 R30=K16R30 R31=K16R31 R32=K16R32; ports GND=GND HOLD=HOLD16 L=L OUT=LOUT16 PULL=PULL16 VDD=5V

### Notes on the sheet
- Coil resistance = 125 R
  R_DSON = 5 R
  Pull (PULL ON + HOLD ON):
  Coil voltage = 3.78 V
  Coil current = 30 mA
  Hold (PULL OFF + HOLD ON):
  Coil voltage = 1.11 V
  Coil current = 9 mA
- Title:
- Project:
- Rev:
- Address:
- Description:
- Created:
- Author:
- Company:
- Edited:
- Contact:
- Sheet
- of
- Ofiar Katynia 21
- 72-100 Goleniów
- Poland
- File:

### Library data of the parts
D2 = FR05xFL: as D1 on sheet top; Identifier: FR05JFL
K1 = PCJ-1xxD3M.301: Miniature PCB Relay PCJ; Manufacturer: TE Connectivity; Identifier: PCJ-105D3M.301
Q1 Q2 = BSS123: N-Channel Logic Level Enhancement Mode Field Effect Transistor; V_GS_tres: 2V; V_GSS: +-20V; V_DSS: 100V; I_D: 170mA; Identifier: BSS123
R29-R32 = Resistor: Generic resistor symbol; Manufacturer: *; Identifier: *; Datasheet: *
  R29: Value: 33R
  R30: Value: 430R
  R31 R32: Value: 10k

## Sheet sbc.SchDoc: BeagleBone Black connectors
size A4; Date: 2023-02-11; DocumentNumber: 6; SheetNumber: 2; SheetTotal: 6
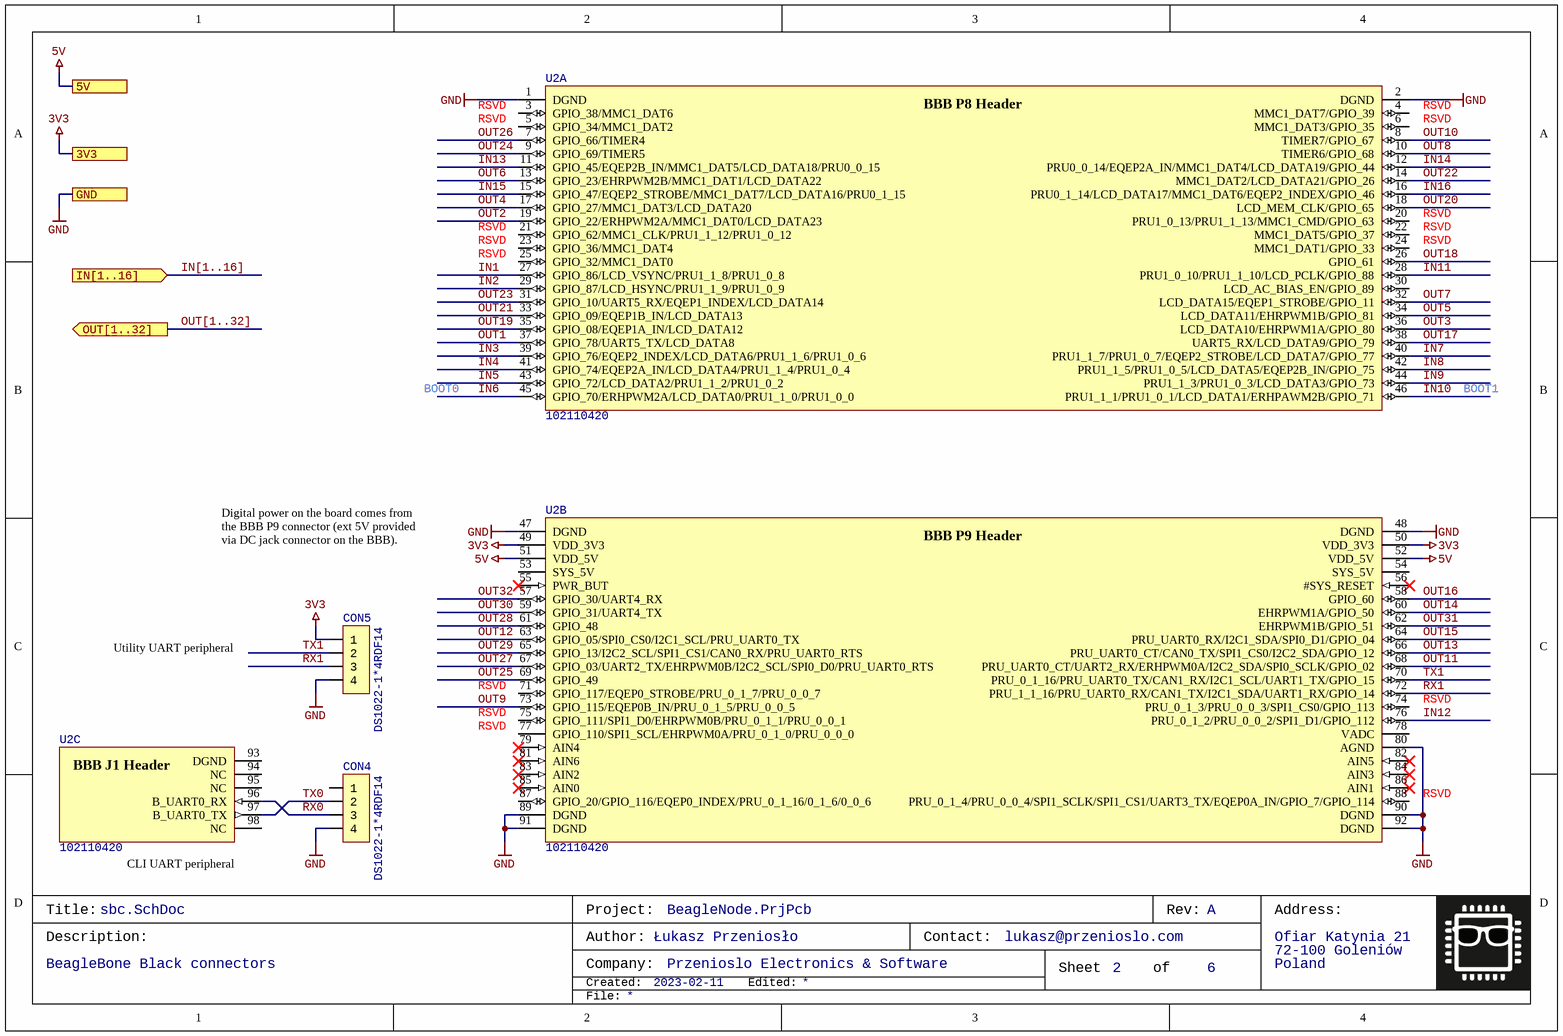
[diagram p5: sbc.SchDoc]

### Parts
CON4  DS1022-1*4RDF14  [HMTA_1X4_2.54_3.60]
CON5  DS1022-1*4RDF14  [HMTA_1X4_2.54_3.60]
U2  102110420  [BeagleBone Black No Bat]  (parts A,B,C of 3)

### Ports
3V3, 5V, GND, IN[1..16] (in), OUT[1..32] (out)

### Nets
3V3: CON5.1 U2.49(VDD_3V3) U2.50(VDD_3V3) ; port 3V3
5V: U2.51(VDD_5V) U2.52(VDD_5V) ; port 5V
GND: CON4.4 CON5.4 U2.1(DGND) U2.2(DGND) U2.47(DGND) U2.48(DGND) U2.80(AGND) U2.89(DGND) U2.90(DGND) U2.91(DGND) U2.92(DGND) ; port GND
IN1: U2.27(GPIO_86/LCD_VSYNC/PRU1_1_8/PRU1_0_8)
IN2: U2.29(GPIO_87/LCD_HSYNC/PRU1_1_9/PRU1_0_9)
IN3: U2.39(GPIO_76/EQEP2_INDEX/LCD_DATA6/PRU1_1_6/PRU1_0_6)
IN4: U2.41(GPIO_74/EQEP2A_IN/LCD_DATA4/PRU1_1_4/PRU1_0_4)
IN5: U2.43(GPIO_72/LCD_DATA2/PRU1_1_2/PRU1_0_2)
IN6: U2.45(GPIO_70/ERHPWM2A/LCD_DATA0/PRU1_1_0/PRU1_0_0)
IN7: U2.40(PRU1_1_7/PRU1_0_7/EQEP2_STROBE/LCD_DATA7/GPIO_77)
IN8: U2.42(PRU1_1_5/PRU1_0_5/LCD_DATA5/EQEP2B_IN/GPIO_75)
IN9: U2.44(PRU1_1_3/PRU1_0_3/LCD_DATA3/GPIO_73)
IN10: U2.46(PRU1_1_1/PRU1_0_1/LCD_DATA1/ERHPAWM2B/GPIO_71)
IN11: U2.28(PRU1_0_10/PRU1_1_10/LCD_PCLK/GPIO_88)
IN12: U2.76(PRU_0_1_2/PRU_0_0_2/SPI1_D1/GPIO_112)
IN13: U2.11(GPIO_45/EQEP2B_IN/MMC1_DAT5/LCD_DATA18/PRU0_0_15)
IN14: U2.12(PRU0_0_14/EQEP2A_IN/MMC1_DAT4/LCD_DATA19/GPIO_44)
IN15: U2.15(GPIO_47/EQEP2_STROBE/MMC1_DAT7/LCD_DATA16/PRU0_1_15)
IN16: U2.16(PRU0_1_14/LCD_DATA17/MMC1_DAT6/EQEP2_INDEX/GPIO_46)
OUT1: U2.37(GPIO_78/UART5_TX/LCD_DATA8)
OUT2: U2.19(GPIO_22/ERHPWM2A/MMC1_DAT0/LCD_DATA23)
OUT3: U2.36(LCD_DATA10/EHRPWM1A/GPIO_80)
OUT4: U2.17(GPIO_27/MMC1_DAT3/LCD_DATA20)
OUT5: U2.34(LCD_DATA11/EHRPWM1B/GPIO_81)
OUT6: U2.13(GPIO_23/EHRPWM2B/MMC1_DAT1/LCD_DATA22)
OUT7: U2.32(LCD_DATA15/EQEP1_STROBE/GPIO_11)
OUT8: U2.10(TIMER6/GPIO_68)
OUT9: U2.73(GPIO_115/EQEP0B_IN/PRU_0_1_5/PRU_0_0_5)
OUT10: U2.8(TIMER7/GPIO_67)
OUT11: U2.68(PRU_UART0_CT/UART2_RX/ERHPWM0A/I2C2_SDA/SPI0_SCLK/GPIO_02)
OUT12: U2.63(GPIO_05/SPI0_CS0/I2C1_SCL/PRU_UART0_TX)
OUT13: U2.66(PRU_UART0_CT/CAN0_TX/SPI1_CS0/I2C2_SDA/GPIO_12)
OUT14: U2.60(EHRPWM1A/GPIO_50)
OUT15: U2.64(PRU_UART0_RX/I2C1_SDA/SPI0_D1/GPIO_04)
OUT16: U2.58(GPIO_60)
OUT17: U2.38(UART5_RX/LCD_DATA9/GPIO_79)
OUT18: U2.26(GPIO_61)
OUT19: U2.35(GPIO_08/EQEP1A_IN/LCD_DATA12)
OUT20: U2.18(LCD_MEM_CLK/GPIO_65)
OUT21: U2.33(GPIO_09/EQEP1B_IN/LCD_DATA13)
OUT22: U2.14(MMC1_DAT2/LCD_DATA21/GPIO_26)
OUT23: U2.31(GPIO_10/UART5_RX/EQEP1_INDEX/LCD_DATA14)
OUT24: U2.9(GPIO_69/TIMER5)
OUT25: U2.69(GPIO_49)
OUT26: U2.7(GPIO_66/TIMER4)
OUT27: U2.67(GPIO_03/UART2_TX/EHRPWM0B/I2C2_SCL/SPI0_D0/PRU_UART0_RTS)
OUT28: U2.61(GPIO_48)
OUT29: U2.65(GPIO_13/I2C2_SCL/SPI1_CS1/CAN0_RX/PRU_UART0_RTS)
OUT30: U2.59(GPIO_31/UART4_TX)
OUT31: U2.62(EHRPWM1B/GPIO_51)
OUT32: U2.57(GPIO_30/UART4_RX)
RX0: CON4.3 U2.96(B_UART0_RX)  [project net RX0_2]
RX1: CON5.3 U2.72(PRU_1_1_16/PRU_UART0_RX/CAN1_TX/I2C1_SDA/UART1_RX/GPIO_14)  [project net RX1_2]
TX0: CON4.2 U2.97(B_UART0_TX)  [project net TX0_2]
TX1: CON5.2 U2.70(PRU_0_1_16/PRU_UART0_TX/CAN1_RX/I2C1_SCL/UART1_TX/GPIO_15)  [project net TX1_2]

Not connected (* = marked no-connect by the designer): CON4 1; U2 3(GPIO_38/MMC1_DAT6) 4(MMC1_DAT7/GPIO_39) 5(GPIO_34/MMC1_DAT2) 6(MMC1_DAT3/GPIO_35) 20(PRU1_0_13/PRU1_1_13/MMC1_CMD/GPIO_63) 21(GPIO_62/MMC1_CLK/PRU1_1_12/PRU1_0_12) 22(MMC1_DAT5/GPIO_37) 23(GPIO_36/MMC1_DAT4) 24(MMC1_DAT1/GPIO_33) 25(GPIO_32/MMC1_DAT0) 30(LCD_AC_BIAS_EN/GPIO_89) 53(SYS_5V) 54(SYS_5V) 55(PWR_BUT)* 56(#SYS_RESET)* 71(GPIO_117/EQEP0_STROBE/PRU_0_1_7/PRU_0_0_7) 74(PRU_0_1_3/PRU_0_0_3/SPI1_CS0/GPIO_113) 75(GPIO_111/SPI1_D0/EHRPWM0B/PRU_0_1_1/PRU_0_0_1) 77(GPIO_110/SPI1_SCL/EHRPWM0A/PRU_0_1_0/PRU_0_0_0) 78(VADC) 79(AIN4)* 81(AIN6)* 82(AIN5)* 83(AIN2)* 84(AIN3)* 85(AIN0)* 86(AIN1)* 87(GPIO_20/GPIO_116/EQEP0_INDEX/PRU_0_1_16/0_1_6/0_0_6) 88(PRU_0_1_4/PRU_0_0_4/SPI1_SCLK/SPI1_CS1/UART3_TX/EQEP0A_IN/GPIO_7/GPIO_114) 93(DGND) 94(NC) 95(NC) 98(NC)

### Buses and harness runs
bus IN[1..16] = port IN[1..16]
bus OUT[1..32] = port OUT[1..32]

### Notes on the sheet
- (near U2) RSVD
- BOOT0
- BOOT1
- Digital power on the board comes from the BBB P9 connector (ext 5V provided via DC jack connector on the BBB).
- Utility UART peripheral
- (near U2) CLI UART peripheral
- Title:
- Project:
- Rev:
- Address:
- Description:
- Created:
- Author:
- Company:
- Edited:
- Contact:
- Sheet
- of
- Ofiar Katynia 21
- 72-100 Goleniów
- Poland
- File:
- (in symbol Beaglebone Black No Bat, part A) BBB P8 Header
- (in symbol Beaglebone Black No Bat, part B) BBB P9 Header
- (in symbol Beaglebone Black No Bat, part C) BBB J1 Header

### Library data of the parts
CON4 CON5 = HMTA_1X4_2.54_3.60: Pin header; pin strips; C-Grid III; male; PIN: 4; angled 90°; THT; Manufacturer: CONNFLY; Nominal Current: 1A; Identifier: DS1022-1*4RDF14
U2 = Beaglebone Black No Bat: BeagleBone Black female headers without the battery 4 pin header; Manufacturer: BeagleBoard; Identifier: 102110420

## Nets that join several sheets
3V3: U_input/IA (IAR1.2 IAR4.2 IAR7.2 IAR10.2), U_input/IB (IBR1.2 IBR4.2 IBR7.2 IBR10.2), U_input/IC (ICR1.2 ICR4.2 ICR7.2 ICR10.2), U_input/ID (IDR1.2 IDR4.2 IDR7.2 IDR10.2), sbc (CON5.1 U2.49 U2.50)
5V: U_output/K1 (K1D2.1 K1K1.A2), U_output/K2 (K2D2.1 K2K1.A2), U_output/K3 (K3D2.1 K3K1.A2), U_output/K4 (K4D2.1 K4K1.A2), U_output/K5 (K5D2.1 K5K1.A2), U_output/K6 (K6D2.1 K6K1.A2), U_output/K7 (K7D2.1 K7K1.A2), U_output/K8 (K8D2.1 K8K1.A2), U_output/K9 (K9D2.1 K9K1.A2), U_output/K10 (K10D2.1 K10K1.A2), U_output/K11 (K11D2.1 K11K1.A2), U_output/K12 (K12D2.1 K12K1.A2), U_output/K13 (K13D2.1 K13K1.A2), U_output/K14 (K14D2.1 K14K1.A2), U_output/K15 (K15D2.1 K15K1.A2), U_output/K16 (K16D2.1 K16K1.A2), sbc (U2.51 U2.52)
GND: U_input/IA (IAU1.9 IAU1.11 IAU1.13 IAU1.15), U_input/IB (IBU1.9 IBU1.11 IBU1.13 IBU1.15), U_input/IC (ICU1.9 ICU1.11 ICU1.13 ICU1.15), U_input/ID (IDU1.9 IDU1.11 IDU1.13 IDU1.15), U_output/K1 (K1Q1.2 K1Q2.2 K1R31.2 K1R32.2), U_output/K2 (K2Q1.2 K2Q2.2 K2R31.2 K2R32.2), U_output/K3 (K3Q1.2 K3Q2.2 K3R31.2 K3R32.2), U_output/K4 (K4Q1.2 K4Q2.2 K4R31.2 K4R32.2), U_output/K5 (K5Q1.2 K5Q2.2 K5R31.2 K5R32.2), U_output/K6 (K6Q1.2 K6Q2.2 K6R31.2 K6R32.2), U_output/K7 (K7Q1.2 K7Q2.2 K7R31.2 K7R32.2), U_output/K8 (K8Q1.2 K8Q2.2 K8R31.2 K8R32.2), U_output/K9 (K9Q1.2 K9Q2.2 K9R31.2 K9R32.2), U_output/K10 (K10Q1.2 K10Q2.2 K10R31.2 K10R32.2), U_output/K11 (K11Q1.2 K11Q2.2 K11R31.2 K11R32.2), U_output/K12 (K12Q1.2 K12Q2.2 K12R31.2 K12R32.2), U_output/K13 (K13Q1.2 K13Q2.2 K13R31.2 K13R32.2), U_output/K14 (K14Q1.2 K14Q2.2 K14R31.2 K14R32.2), U_output/K15 (K15Q1.2 K15Q2.2 K15R31.2 K15R32.2), U_output/K16 (K16Q1.2 K16Q2.2 K16R31.2 K16R32.2), sbc (11 pins)
L: top (CON2.2), U_output/K1 (K1K1.11), U_output/K2 (K2K1.11), U_output/K3 (K3K1.11), U_output/K4 (K4K1.11), U_output/K5 (K5K1.11), U_output/K6 (K6K1.11), U_output/K7 (K7K1.11), U_output/K8 (K8K1.11), U_output/K9 (K9K1.11), U_output/K10 (K10K1.11), U_output/K11 (K11K1.11), U_output/K12 (K12K1.11), U_output/K13 (K13K1.11), U_output/K14 (K14K1.11), U_output/K15 (K15K1.11), U_output/K16 (K16K1.11)
N: top (D1.2), U_input/IA (IAU1.2 IAU1.4 IAU1.6 IAU1.8), U_input/IB (IBU1.2 IBU1.4 IBU1.6 IBU1.8), U_input/IC (ICU1.2 ICU1.4 ICU1.6 ICU1.8), U_input/ID (IDU1.2 IDU1.4 IDU1.6 IDU1.8)
HOLD1: output (R49.2), U_output/K1 (K1Q2.1 K1R32.1)
HOLD2: output (R50.2), U_output/K2 (K2Q2.1 K2R32.1)
HOLD3: output (R51.2), U_output/K3 (K3Q2.1 K3R32.1)
HOLD4: output (R52.2), U_output/K4 (K4Q2.1 K4R32.1)
HOLD5: output (R53.2), U_output/K5 (K5Q2.1 K5R32.1)
HOLD6: output (R54.2), U_output/K6 (K6Q2.1 K6R32.1)
HOLD7: output (R55.2), U_output/K7 (K7Q2.1 K7R32.1)
HOLD8: output (R56.2), U_output/K8 (K8Q2.1 K8R32.1)
HOLD9: output (R57.2), U_output/K9 (K9Q2.1 K9R32.1)
HOLD10: output (R58.2), U_output/K10 (K10Q2.1 K10R32.1)
HOLD11: output (R59.2), U_output/K11 (K11Q2.1 K11R32.1)
HOLD12: output (R60.2), U_output/K12 (K12Q2.1 K12R32.1)
HOLD13: output (R61.2), U_output/K13 (K13Q2.1 K13R32.1)
HOLD14: output (R62.2), U_output/K14 (K14Q2.1 K14R32.1)
HOLD15: output (R63.2), U_output/K15 (K15Q2.1 K15R32.1)
HOLD16: output (R64.2), U_output/K16 (K16Q2.1 K16R32.1)
IN1: input (R13.1), sbc (U2.27)
IN2: input (R14.1), sbc (U2.29)
IN3: input (R15.1), sbc (U2.39)
IN4: input (R16.1), sbc (U2.41)
IN5: input (R17.1), sbc (U2.43)
IN6: input (R18.1), sbc (U2.45)
IN7: input (R19.1), sbc (U2.40)
IN8: input (R20.1), sbc (U2.42)
IN9: input (R21.1), sbc (U2.44)
IN10: input (R22.1), sbc (U2.46)
IN11: input (R23.1), sbc (U2.28)
IN12: input (R24.1), sbc (U2.76)
IN13: input (R25.1), sbc (U2.11)
IN14: input (R26.1), sbc (U2.12)
IN15: input (R27.1), sbc (U2.15)
IN16: input (R28.1), sbc (U2.16)
LOUT1: output (CON3.16), U_output/K1 (K1K1.14)
LOUT2: output (CON3.15), U_output/K2 (K2K1.14)
LOUT3: output (CON3.14), U_output/K3 (K3K1.14)
LOUT4: output (CON3.13), U_output/K4 (K4K1.14)
LOUT5: output (CON3.12), U_output/K5 (K5K1.14)
LOUT6: output (CON3.11), U_output/K6 (K6K1.14)
LOUT7: output (CON3.10), U_output/K7 (K7K1.14)
LOUT8: output (CON3.9), U_output/K8 (K8K1.14)
LOUT9: output (CON3.8), U_output/K9 (K9K1.14)
LOUT10: output (CON3.7), U_output/K10 (K10K1.14)
LOUT11: output (CON3.6), U_output/K11 (K11K1.14)
LOUT12: output (CON3.5), U_output/K12 (K12K1.14)
LOUT13: output (CON3.4), U_output/K13 (K13K1.14)
LOUT14: output (CON3.3), U_output/K14 (K14K1.14)
LOUT15: output (CON3.2), U_output/K15 (K15K1.14)
LOUT16: output (CON3.1), U_output/K16 (K16K1.14)
OUT1: output (R33.1), sbc (U2.37)
OUT2: output (R34.1), sbc (U2.19)
OUT3: output (R35.1), sbc (U2.36)
OUT4: output (R36.1), sbc (U2.17)
OUT5: output (R37.1), sbc (U2.34)
OUT6: output (R38.1), sbc (U2.13)
OUT7: output (R39.1), sbc (U2.32)
OUT8: output (R40.1), sbc (U2.10)
OUT9: output (R41.1), sbc (U2.73)
OUT10: output (R42.1), sbc (U2.8)
OUT11: output (R43.1), sbc (U2.68)
OUT12: output (R44.1), sbc (U2.63)
OUT13: output (R45.1), sbc (U2.66)
OUT14: output (R46.1), sbc (U2.60)
OUT15: output (R47.1), sbc (U2.64)
OUT16: output (R48.1), sbc (U2.58)
OUT17: output (R49.1), sbc (U2.38)
OUT18: output (R50.1), sbc (U2.26)
OUT19: output (R51.1), sbc (U2.35)
OUT20: output (R52.1), sbc (U2.18)
OUT21: output (R53.1), sbc (U2.33)
OUT22: output (R54.1), sbc (U2.14)
OUT23: output (R55.1), sbc (U2.31)
OUT24: output (R56.1), sbc (U2.9)
OUT25: output (R57.1), sbc (U2.69)
OUT26: output (R58.1), sbc (U2.7)
OUT27: output (R59.1), sbc (U2.67)
OUT28: output (R60.1), sbc (U2.61)
OUT29: output (R61.1), sbc (U2.65)
OUT30: output (R62.1), sbc (U2.59)
OUT31: output (R63.1), sbc (U2.62)
OUT32: output (R64.1), sbc (U2.57)
OUTA1: input (R13.2), U_input/IA (IAR1.1 IAU1.16)
OUTA2: input (R14.2), U_input/IA (IAR4.1 IAU1.14)
OUTA3: input (R15.2), U_input/IA (IAR7.1 IAU1.12)
OUTA4: input (R16.2), U_input/IA (IAR10.1 IAU1.10)
OUTB1: input (R17.2), U_input/IB (IBR1.1 IBU1.16)
OUTB2: input (R18.2), U_input/IB (IBR4.1 IBU1.14)
OUTB3: input (R19.2), U_input/IB (IBR7.1 IBU1.12)
OUTB4: input (R20.2), U_input/IB (IBR10.1 IBU1.10)
OUTC1: input (R21.2), U_input/IC (ICR1.1 ICU1.16)
OUTC2: input (R22.2), U_input/IC (ICR4.1 ICU1.14)
OUTC3: input (R23.2), U_input/IC (ICR7.1 ICU1.12)
OUTC4: input (R24.2), U_input/IC (ICR10.1 ICU1.10)
OUTD1: input (R25.2), U_input/ID (IDR1.1 IDU1.16)
OUTD2: input (R26.2), U_input/ID (IDR4.1 IDU1.14)
OUTD3: input (R27.2), U_input/ID (IDR7.1 IDU1.12)
OUTD4: input (R28.2), U_input/ID (IDR10.1 IDU1.10)
PULL1: output (R33.2), U_output/K1 (K1Q1.1 K1R31.1)
PULL2: output (R34.2), U_output/K2 (K2Q1.1 K2R31.1)
PULL3: output (R35.2), U_output/K3 (K3Q1.1 K3R31.1)
PULL4: output (R36.2), U_output/K4 (K4Q1.1 K4R31.1)
PULL5: output (R37.2), U_output/K5 (K5Q1.1 K5R31.1)
PULL6: output (R38.2), U_output/K6 (K6Q1.1 K6R31.1)
PULL7: output (R39.2), U_output/K7 (K7Q1.1 K7R31.1)
PULL8: output (R40.2), U_output/K8 (K8Q1.1 K8R31.1)
PULL9: output (R41.2), U_output/K9 (K9Q1.1 K9R31.1)
PULL10: output (R42.2), U_output/K10 (K10Q1.1 K10R31.1)
PULL11: output (R43.2), U_output/K11 (K11Q1.1 K11R31.1)
PULL12: output (R44.2), U_output/K12 (K12Q1.1 K12R31.1)
PULL13: output (R45.2), U_output/K13 (K13Q1.1 K13R31.1)
PULL14: output (R46.2), U_output/K14 (K14Q1.1 K14R31.1)
PULL15: output (R47.2), U_output/K15 (K15Q1.1 K15R31.1)
PULL16: output (R48.2), U_output/K16 (K16Q1.1 K16R31.1)